# Altium project BG.PrjPCB
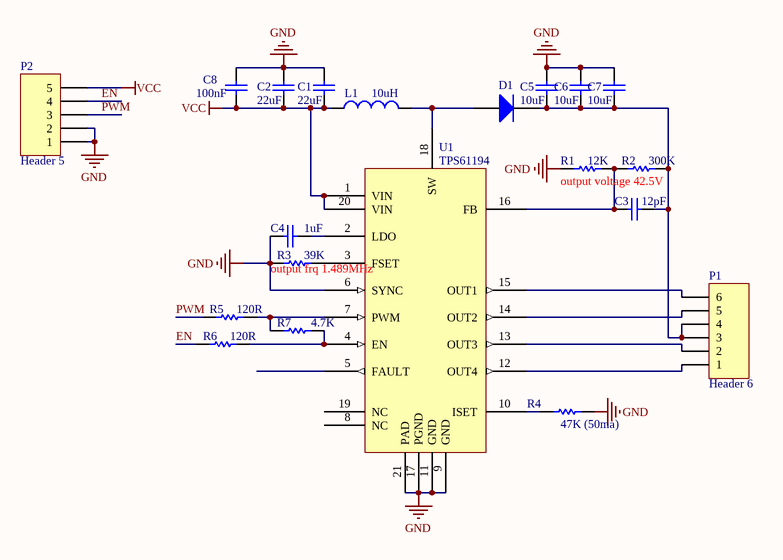
[diagram p0: BGV1.0.SchDoc]
1 sheet, 20 parts. Net scope: global (net labels, ports and power ports of the same name join across sheets).
Board file: BGV1.0.PcbDoc

## Sheet BGV1.0.SchDoc
size A4

### Parts
C1  value 22uF  [3216[1206]]  (hidden comment: Cap)
C2  value 22uF  [3216[1206]]  (hidden comment: Cap)
C3  value 12pF  [0603]  (hidden comment: Cap)
C4  value 1uF  [0603]  (hidden comment: Cap)
C5  value 10uF  [3216[1206]]  (hidden comment: Cap)
C6  value 10uF  [3216[1206]]  (hidden comment: Cap)
C7  value 10uF  [3216[1206]]  (hidden comment: Cap)
C8  value 100nF  [0603]  (hidden comment: Cap)
D1  Diode 1N4448  [SMA]  (value not drawn)
L1  value 10uH  [L-6045]  (hidden comment: Inductor)
P1  Header 6  [1.25mm-6P]
P2  Header 5  [PH2.0-5P-SMT]
R1  value 12K  [0603]  (hidden comment: Res1)
R2  value 300K  [0603]  (hidden comment: Res1)
R3  value 39K  [0603]  (hidden comment: Res1)
R4  value 47K (50ma)  [0603]  (hidden comment: Res1)
R5  value 120R  [0603]  (hidden comment: Res1)
R6  value 120R  [0603]  (hidden comment: Res1)
R7  value 4.7K  [0402]  (hidden comment: Res1)
U1  TPS61194  [HTTSOP-20]

### Nets
GND: C1.1 C2.1 C4.1 C5.1 C6.1 C7.1 C8.2 P2.1 P2.2 R1.1 R3.1 R4.2 U1.6(SYNC) U1.9(GND) U1.11(GND) U1.17(PGND) U1.21(PAD)
VCC: C1.2 C2.2 C8.1 L1.1 P2.5 U1.1(VIN) U1.20(VIN)
EN: P2.4 R6.2
PWM: P2.3 R5.2
NetC3_1: C3.1 R1.2 R2.1 U1.16(FB)
NetC3_2: C3.2 C5.2 C6.2 C7.2 D1.2(K) P1.3 P1.4 R2.2
NetC4_2: C4.2 U1.2(LDO)
NetD1_1: D1.1(A) L1.2 U1.18(SW)
NetP1_1: P1.1 U1.12(OUT4)
NetP1_2: P1.2 U1.13(OUT3)
NetP1_5: P1.5 U1.14(OUT2)
NetP1_6: P1.6 U1.15(OUT1)
NetR3_2: R3.2 U1.3(FSET)
NetR4_1: R4.1 U1.10(ISET)
NetR5_1: R5.1 R7.1 U1.7(PWM)
NetR6_1: R6.1 R7.2 U1.4(EN)

Not connected (* = marked no-connect by the designer): U1 5(FAULT) 8(NC) 19(NC)

### Notes on the sheet
- output voltage 42.5V
- output frq 1.489MHz

### Library data of the parts
C1-C8 = Cap: Capacitor; Published: 8-Jun-2000; LatestRevisionDate: 17-Jul-2002; LatestRevisionNote: Re-released for DXP Platform.; PackageReference: RAD-0.3; Publisher: Altium Limited
D1 = Diode 1N4448: High Conductance Fast Diode; Published: 8-Jun-2000; LatestRevisionDate: 17-Jul-2002; LatestRevisionNote: Re-released for DXP Platform.; DatasheetDocument: 1997; PackageReference: DO-35; Publisher: Altium Limited; Code_JEDEC: DO-204-AH; ComponentLink1Description: Manufacturer Link; ComponentLink1URL: http://www.fairchildsemi.com/; ComponentLink2Description: Datasheet; ComponentLink2URL: http://www.fairchildsemi.com/ds/1N%2F1N4448.pdf
L1 = Inductor: Code_IEC: 1005; Published: 8-Jun-2000; LatestRevisionDate: 17-Jul-2002; LatestRevisionNote: Re-released for DXP Platform.; PackageReference: 0402-A; Publisher: Altium Limited; Code_JEITA: 0402
P1 = Header 6: Header, 6-Pin; LatestRevisionDate: 17-Jul-2002; LatestRevisionNote: Re-released for DXP Platform.; Publisher: Altium Limited
P2 = Header 5: Header, 5-Pin; LatestRevisionDate: 17-Jul-2002; LatestRevisionNote: Re-released for DXP Platform.; Publisher: Altium Limited
R1-R7 = Res1: Resistor; Published: 8-Jun-2000; LatestRevisionDate: 17-Jul-2002; LatestRevisionNote: Re-released for DXP Platform.; PackageReference: AXIAL-0.3; Publisher: Altium Limited